# Altium schematic sheet TwelfthMan.SchDoc
size B; SheetNumber: 1; SheetTotal: 1
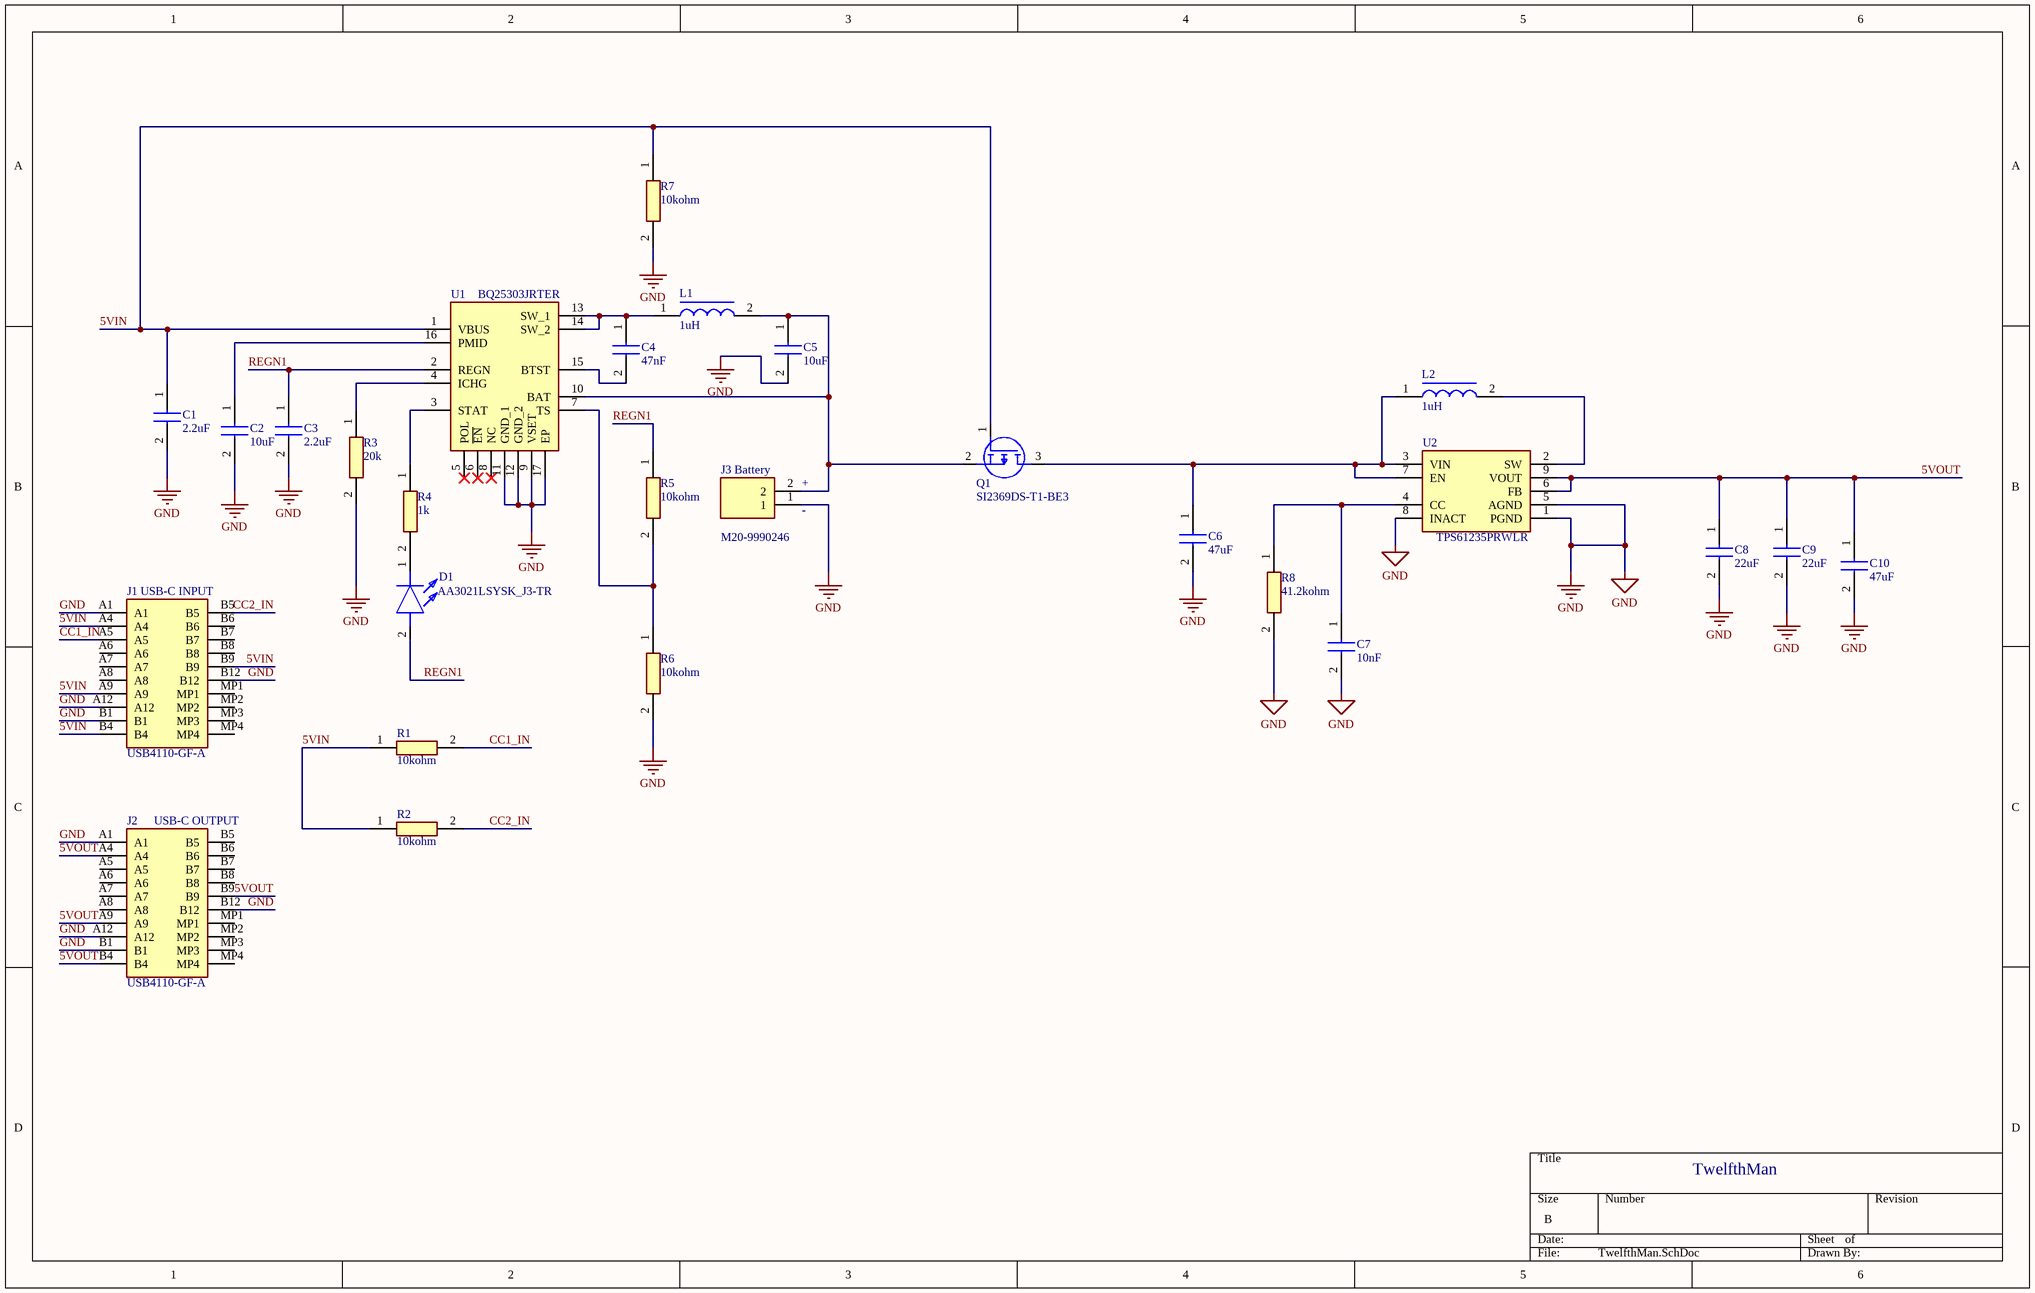
[diagram p0: TwelfthMan.SchDoc]

## Parts
C1  2.2uF  [C3216_Commercial]
C2  10uF  [CAPC3216X190N]
C3  2.2uF  [C3216_Commercial]
C4  47nF  [CAPC3216X175N]
C5  10uF  [CAPC3216X190N]
C6  47uF  [C2012_Commercial]
C7  10nF  [C2012_Commercial]
C8  22uF  [C2012_Commercial]
C9  22uF  [C2012_Commercial]
C10  47uF  [C2012_Commercial]
D1  AA3021LSYSK_J3-TR  [AA3021LSYSKJ3TR]
J1  USB4110-GF-A  [USB4110GFA]
J2  USB4110-GF-A  [USB4110GFA]
J3  M20-9990246  [HDRV2W66P0X254_1X2_508X254X874P]
L1  1uH  [SPM6530]
L2  1uH  [SPM6530]
Q1  SI2369DS-T1-BE3  [SOT95P237X112-3N]
R1  10kohm  [RESC2012X60N]
R2  10kohm  [RESC2012X60N]
R3  20k  [RESC3216X65N]
R4  1k  [RCC1206_e3]
R5  10kohm  [RESC2012X60N]
R6  10kohm  [RESC2012X60N]
R7  10kohm  [RESC2012X60N]
R8  41.2kohm  [RESC2012X65N]
U1  BQ25303JRTER  [QFN50P300X300X80-17N-D]
U2  TPS61235PRWLR  [TPS61235PRWLT]

## Nets
GND: C1.2 C2.2 C3.2 C5.2 C6.2 C7.2 C8.2 C9.2 C10.2 J1.A1 J1.A12 J1.B1 J1.B12 J2.A1 J2.A12 J2.B1 J2.B12 J3.1 R3.2 R6.2 R7.2 R8.2 U1.9(VSET) U1.11(GND_1) U1.12(GND_2) U1.17(EP) U2.1(PGND) U2.5(AGND) U2.8(INACT)
5VIN: C1.1 J1.A4 J1.A9 J1.B4 J1.B9 Q1.1(G) R1.1 R2.1 R7.1 U1.1(VBUS)
5VOUT: C8.1 C9.1 C10.1 J2.A4 J2.A9 J2.B4 J2.B9 U2.6(FB) U2.9(VOUT)
CC1_IN: J1.A5 R1.2
CC2_IN: J1.B5 R2.2
REGN1: C3.1 D1.2(A) R5.1 U1.2(REGN)
NetC2_1: C2.1 U1.16(PMID)
NetC4_1: C4.1 L1.1 U1.13(SW_1) U1.14(SW_2)
NetC4_2: C4.2 U1.15(BTST)
NetC5_1: C5.1 J3.2 L1.2 Q1.2(S) U1.10(BAT)
NetC6_1: C6.1 L2.1 Q1.3(D) U2.3(VIN) U2.7(EN)
NetC7_1: C7.1 R8.1 U2.4(CC)
NetD1_1: D1.1(K) R4.2
NetL2_2: L2.2 U2.2(SW)
NetR3_1: R3.1 U1.4(ICHG)
NetR4_1: R4.1 U1.3(STAT)
NetR5_2: R5.2 R6.1 U1.7(TS)

Not connected (* = marked no-connect by the designer): J1 A6 A7 A8 B6 B7 B8 MP1 MP2 MP3 MP4; J2 A5 A6 A7 A8 B5 B6 B7 B8 MP1 MP2 MP3 MP4; U1 5(POL)* 6(~{EN})* 8(NC)*

## Notes on the sheet
- (near J3) Battery
- (near J3) +
- (near J3) -
- (near J1) USB-C INPUT
- (near J2) USB-C OUTPUT
- TwelfthMan

## Library data of the parts
C1 C3 = C3216X7R1V225K160AE: Capacitor - C3216X7R1V225K160AE; Manufacturer_Name: TDK; Datasheet Link: https://product.tdk.com/system/files/dam/doc/product/capacitor/ceramic/mlcc/catalog/mlcc_commercial_soft_en.pdf; Height: 0.75mm; Manufacturer_Part_Number: C3216X7R1V225K160AE; Mouser Part Number: 810-C3216X7R1V225KAE; Mouser Price/Stock: https://www.mouser.co.uk/ProductDetail/TDK/C3216X7R1V225K160AE?qs=nQSIdc08i%252Bcchfc%2FLB33PA%3D%3D
C2 C5 = CNA5L1X7R1E106K160AE: Capacitor - CNA5L1X7R1E106K160AE; Manufacturer_Name: TDK; Datasheet Link: https://product.tdk.com/system/files/dam/doc/product/capacitor/ceramic/mlcc/catalog/mlcc_automotive_soft_cna_en.pdf; Height: 1.9mm; Manufacturer_Part_Number: CNA5L1X7R1E106K160AE; Mouser Part Number: 810-CNA5LX7R1E106K16; Mouser Price/Stock: https://www.mouser.co.uk/ProductDetail/TDK/CNA5L1X7R1E106K160AE?qs=81r%252BiQLm7BR08r%2Fq9dBc7Q%3D%3D; Arrow Part Number: CNA5L1X7R1E106K160AE; Arrow Price/Stock: https://www.arrow.com/en/products/cna5l1x7r1e106k160ae/tdk?region=nac
C4 = C1206C561KDGACAUTO: Capacitor - C1206C561KDGACAUTO; Manufacturer_Name: KEMET; Datasheet Link: https://www.kemet.com/specsheet/C1206C561KDGACAUTO; Height: 1.75mm; Manufacturer_Part_Number: C1206C561KDGACAUTO; Mouser Part Number: 80-C1206C561KDGAUTO; Mouser Price/Stock: https://www.mouser.co.uk/ProductDetail/KEMET/C1206C561KDGACAUTO?qs=MyNHzdoqoQL%252BgGDPneTOTA%3D%3D
C6 C10 = C2012X5R1A476M125AC: Capacitor - C2012X5R1A476M125AC; Manufacturer_Name: TDK; Datasheet Link: https://product.tdk.com/system/files/dam/doc/product/capacitor/ceramic/mlcc/catalog/mlcc_commercial_general_en.pdf; Height: 0.75mm; Manufacturer_Part_Number: C2012X5R1A476M125AC; Mouser Part Number: 810-C2012X5R1A476M; Mouser Price/Stock: https://www.mouser.co.uk/ProductDetail/TDK/C2012X5R1A476M125AC?qs=LcTL%2F5vFEzGyFw5hxP%2FMXw%3D%3D; Arrow Part Number: C2012X5R1A476M125AC; Arrow Price/Stock: https://www.arrow.com/en/products/c2012x5r1a476m125ac/tdk?region=nac
C7 = C2012X5R2E103K125AA: Capacitor - C2012X5R2E103K125AA; Manufacturer_Name: TDK; Datasheet Link: https://product.tdk.com/system/files/dam/doc/product/capacitor/ceramic/mlcc/catalog/mlcc_commercial_midvoltage_en.pdf; Height: 0.75mm; Manufacturer_Part_Number: C2012X5R2E103K125AA; Mouser Part Number: 810-C2012X5R2E103K1A; Mouser Price/Stock: https://www.mouser.com/Search/Refine.aspx?Keyword=810-C2012X5R2E103K1A; Arrow Part Number: C2012X5R2E103K125AA; Arrow Price/Stock: https://www.arrow.com/en/products/c2012x5r2e103k125aa/tdk?region=nac
C8 C9 = C2012X5R1A226M125AB: Capacitor - C2012X5R1A226M125AB; Manufacturer_Name: TDK; Datasheet Link: https://product.tdk.com/system/files/dam/doc/product/capacitor/ceramic/mlcc/catalog/mlcc_commercial_general_en.pdf; Height: 0.75mm; Manufacturer_Part_Number: C2012X5R1A226M125AB; Mouser Part Number: 810-C2012X5R1A226M-3; Mouser Price/Stock: https://www.mouser.co.uk/ProductDetail/TDK/C2012X5R1A226M125AB?qs=LcTL%2F5vFEzEl81ah%2FUQuuw%3D%3D; Arrow Part Number: C2012X5R1A226M125AB; Arrow Price/Stock: https://www.arrow.com/en/products/c2012x5r1a226m125ab/tdk?region=nac
D1 = AA3021LSYSK_J3-TR: LED-AA3021LSYSK_J3-TR; Manufacturer_Name: Kingbright; Manufacturer_Part_Number: AA3021LSYSK/J3-TR; Datasheet Link: https://eagle.componentsearchengine.com/Datasheets/1/AA3021LSYSK_J3-TR.pdf; Height: 1.3mm; Mouser Part Number: 604-AA3021LSYSK/J3TR; Mouser Price/Stock: https://www.mouser.co.uk/ProductDetail/Kingbright/AA3021LSYSK-J3-TR?qs=Oo40KB9lBTmS1V8p5PSO3Q%3D%3D
J1 J2 = USB4110-GF-A: Connector; Manufacturer_Name: GCT (GLOBAL CONNECTOR TECHNOLOGY); Datasheet Link: https://gct.co/files/drawings/usb4110.pdf; Height: 3.26mm; Manufacturer_Part_Number: USB4110-GF-A; Mouser Part Number: 640-USB4110-GF-A; Mouser Price/Stock: https://www.mouser.co.uk/ProductDetail/GCT/USB4110-GF-A?qs=KUoIvG%2F9IlYiZvIXQjyJeA%3D%3D
J3 = M20-9990246: Connector; Manufacturer_Name: Harwin; Datasheet Link: https://cdn.harwin.com/pdfs/M20-999.pdf; Height: 8.74mm; Manufacturer_Part_Number: M20-9990246; Mouser Part Number: 855-M20-9990246; Mouser Price/Stock: https://www.mouser.co.uk/ProductDetail/Harwin/M20-9990246?qs=Jph8NoUxIfWjw4WmyRvzag%3D%3D
L1 L2 = SPM6530T-1R0M120: Inductor (FeSi Core) - SPM6530T-1R0M120; Manufacturer_Name: TDK; Datasheet Link: https://product.tdk.com/system/files/dam/doc/product/inductor/inductor/smd/catalog/inductor_commercial_power_spm6530_en.pdf; Manufacturer_Part_Number: SPM6530T-1R0M120; Mouser Part Number: 810-SPM6530T-1R0M120; Mouser Price/Stock: https://www.mouser.co.uk/ProductDetail/TDK/SPM6530T-1R0M120?qs=chjFIDm9dbpAC3nWIRa%252B5A%3D%3D; Arrow Part Number: SPM6530T-1R0M120; Arrow Price/Stock: https://www.arrow.com/en/products/spm6530t-1r0m120/tdk?region=nac
Q1 = SI2369DS-T1-BE3: MOSFET (P-Channel); Manufacturer_Name: Vishay; Datasheet Link: https://www.mouser.com/datasheet/2/427/si2369d-1764360.pdf; Height: 1.12mm; Manufacturer_Part_Number: SI2369DS-T1-BE3; Mouser Part Number: 78-SI2369DS-T1-BE3; Mouser Price/Stock: https://www.mouser.co.uk/ProductDetail/Vishay-Siliconix/SI2369DS-T1-BE3?qs=CiayqK2gdcIOn%252BvoBWrtBg%3D%3D; Arrow Part Number: SI2369DS-T1-BE3; Arrow Price/Stock: https://www.arrow.com/en/products/si2369ds-t1-be3/vishay?region=nac
R1 R2 R5-R7 = CHP0805-FX-1002ELF: Resistor - CHP0805-FX-1002ELF; Manufacturer_Name: Bourns; Datasheet Link: https://ms.componentsearchengine.com/Datasheets/1/CHP0805-FX-1002ELF.pdf; Height: 0.6mm; Manufacturer_Part_Number: CHP0805-FX-1002ELF; Mouser Part Number: 652-CHP0805FX1002ELF; Mouser Price/Stock: https://www.mouser.co.uk/ProductDetail/Bourns/CHP0805-FX-1002ELF?qs=lc2O%252BfHJPVaDI6gsPdDtfw%3D%3D
R3 = RCS120620K0FKEA: Resistor - RCS120620K0FKEA; Manufacturer_Name: Vishay; Datasheet Link: https://componentsearchengine.com/Datasheets/1/RCS120620K0FKEA.pdf; Height: 0.65mm; Manufacturer_Part_Number: RCS120620K0FKEA; Mouser Part Number: 71-RCS120620K0FKEA; Mouser Price/Stock: https://www.mouser.com/Search/Refine.aspx?Keyword=71-RCS120620K0FKEA
R4 = RCC12061K00FKEA: Resistor - RCC12061K00FKEA; Manufacturer_Name: Vishay; Datasheet Link: https://www.vishay.com/docs/20066/rcce3.pdf; Height: 0.6mm; Manufacturer_Part_Number: RCC12061K00FKEA; Mouser Part Number: 71-RCC12061K00FKEA; Mouser Price/Stock: https://www.mouser.co.uk/ProductDetail/Vishay-Dale/RCC12061K00FKEA?qs=IS%252B4QmGtzzoI2b9zl4DztQ%3D%3D; Arrow Part Number: RCC12061K00FKEA; Arrow Price/Stock: https://www.arrow.com/en/products/rcc12061k00fkea/vishay?region=nac
R8 = RN73C2A41K2BTDF: Resistor - RN73C2A41K2BTDF; Manufacturer_Name: TE Connectivity; Datasheet Link: https://datasheet.datasheetarchive.com/originals/distributors/DKDS42/DSANUWW0051573.pdf; Height: 0.65mm; Manufacturer_Part_Number: RN73C2A41K2BTDF; Mouser Part Number: 279-RN73CA-41.2K; Mouser Price/Stock: https://www.mouser.co.uk/ProductDetail/TE-Connectivity-Holsworthy/RN73C2A41K2BTDF?qs=rthfhr2kfqyM2M8zdDsBjw%3D%3D
U1 = BQ25303JRTER: Integrated Circuit; Manufacturer_Name: Texas Instruments; Datasheet Link: https://www.ti.com/lit/ds/symlink/bq25303j.pdf?ts=1614639374775&ref_url=https%253A%252F%252Fwww.ti.com%252Fpower-management%252Fbattery-management%252Fcharger-ics%252Fproducts.html; Height: 0.8mm; Manufacturer_Part_Number: BQ25303JRTER; Mouser Part Number: 595-BQ25303JRTER; Mouser Price/Stock: https://www.mouser.co.uk/ProductDetail/Texas-Instruments/BQ25303JRTER?qs=DRkmTr78QARA1C7%2F12q3og%3D%3D; Arrow Part Number: BQ25303JRTER; Arrow Price/Stock: https://www.arrow.com/en/products/bq25303jrter/texas-instruments?region=nac
U2 = TPS61235PRWLR: Integrated Circuit - TPS61235PRWLR; Manufacturer_Name: Texas Instruments; Datasheet Link: http://www.ti.com/lit/gpn/tps61235p; Manufacturer_Part_Number: TPS61235PRWLR; Mouser Part Number: 595-TPS61235PRWLR; Mouser Price/Stock: https://www.mouser.co.uk/ProductDetail/Texas-Instruments/TPS61235PRWLR?qs=LuYMPh7GGMQeafv6Awbrsg%3D%3D; Arrow Part Number: TPS61235PRWLR; Arrow Price/Stock: https://www.arrow.com/en/products/tps61235prwlr/texas-instruments?region=nac